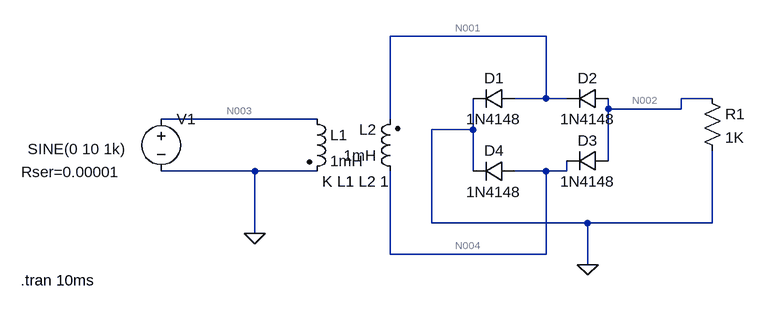
[diagram p0: schematic Draft3.asc]
Draft3.asc, the LTspice schematic file:
Version 4
SHEET 1 880 680
WIRE 416 -48 176 -48
WIRE 416 48 416 -48
WIRE 416 48 368 48
WIRE 448 48 416 48
WIRE 672 48 624 48
WIRE 512 64 512 48
WIRE 624 64 624 48
WIRE 624 64 512 64
WIRE 64 80 -176 80
WIRE 176 80 176 -48
WIRE 304 96 304 48
WIRE 304 96 240 96
WIRE 512 144 512 64
WIRE -32 160 -176 160
WIRE 64 160 -32 160
WIRE 304 160 304 96
WIRE 416 160 368 160
WIRE 448 160 448 144
WIRE 448 160 416 160
WIRE 240 240 240 96
WIRE 480 240 240 240
WIRE 672 240 672 128
WIRE 672 240 480 240
WIRE -32 256 -32 160
WIRE 176 288 176 160
WIRE 416 288 416 160
WIRE 416 288 176 288
WIRE 480 304 480 240
FLAG -32 256 0
FLAG 480 304 0
SYMBOL ind2 48 64 R0
SYMATTR InstName L1
SYMATTR Value 1mH
SYMATTR Type ind
SYMBOL ind2 192 176 R180
WINDOW 0 36 80 Left 2
WINDOW 3 36 40 Left 2
SYMATTR InstName L2
SYMATTR Value 1mH
SYMATTR Type ind
SYMBOL voltage -176 64 R0
WINDOW 3 -205 62 Left 2
WINDOW 123 0 0 Left 0
WINDOW 39 -215 97 Left 2
SYMATTR InstName V1
SYMATTR Value SINE(0 10 1k)
SYMATTR SpiceLine Rser=0.00001
SYMBOL diode 368 32 R90
WINDOW 0 0 32 VBottom 2
WINDOW 3 32 32 VTop 2
SYMATTR InstName D1
SYMATTR Value 1N4148
SYMBOL diode 512 32 R90
WINDOW 0 0 32 VBottom 2
WINDOW 3 32 32 VTop 2
SYMATTR InstName D2
SYMATTR Value 1N4148
SYMBOL diode 512 128 R90
WINDOW 0 0 32 VBottom 2
WINDOW 3 32 32 VTop 2
SYMATTR InstName D3
SYMATTR Value 1N4148
SYMBOL diode 368 144 R90
WINDOW 0 0 32 VBottom 2
WINDOW 3 32 32 VTop 2
SYMATTR InstName D4
SYMATTR Value 1N4148
SYMBOL res 656 32 R0
SYMATTR InstName R1
SYMATTR Value 1K
TEXT 72 176 Left 2 !K L1 L2 1
TEXT -392 328 Left 2 !.tran 10ms

The netlist it stands for:
* Draft3.asc
L1 N003 0 1mH
L2 N004 N001 1mH
V1 N003 0 SINE(0 10 1k) Rser=0.00001
D1 N001 0 1N4148
D2 N002 N001 1N4148
D3 N002 N004 1N4148
D4 N004 0 1N4148
R1 N002 0 1K
.model D D
.lib standard.dio
K L1 L2 1
.tran 10ms
.backanno
.end

* Results of the author's LTspice run, read from the files saved beside the schematic
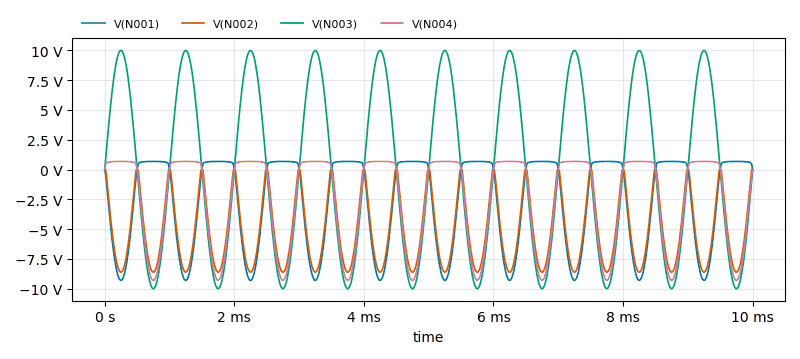
[diagram p1: Transient Analysis of Draft3.asc, plotted from the saved traces]
* Transient Analysis, 1 run:
*   V(N001): min -9.304 V, max 686.7 mV, average -2.551 V, rms 4.593 V, last -15.06 µV
*   V(N002): min -8.617 V, max 1.215 µV, average -5.102 V, rms 5.876 V, last 1.215 µV
*   V(N003): min -10 V, max 10 V, average -46.5 µV, rms 7.067 V, last 0 V
*   V(N004): min -9.304 V, max 686.7 mV, average -2.551 V, rms 4.593 V, last -15.06 µV